# EAGLE design H2OhNo (EAGLE 6.4)
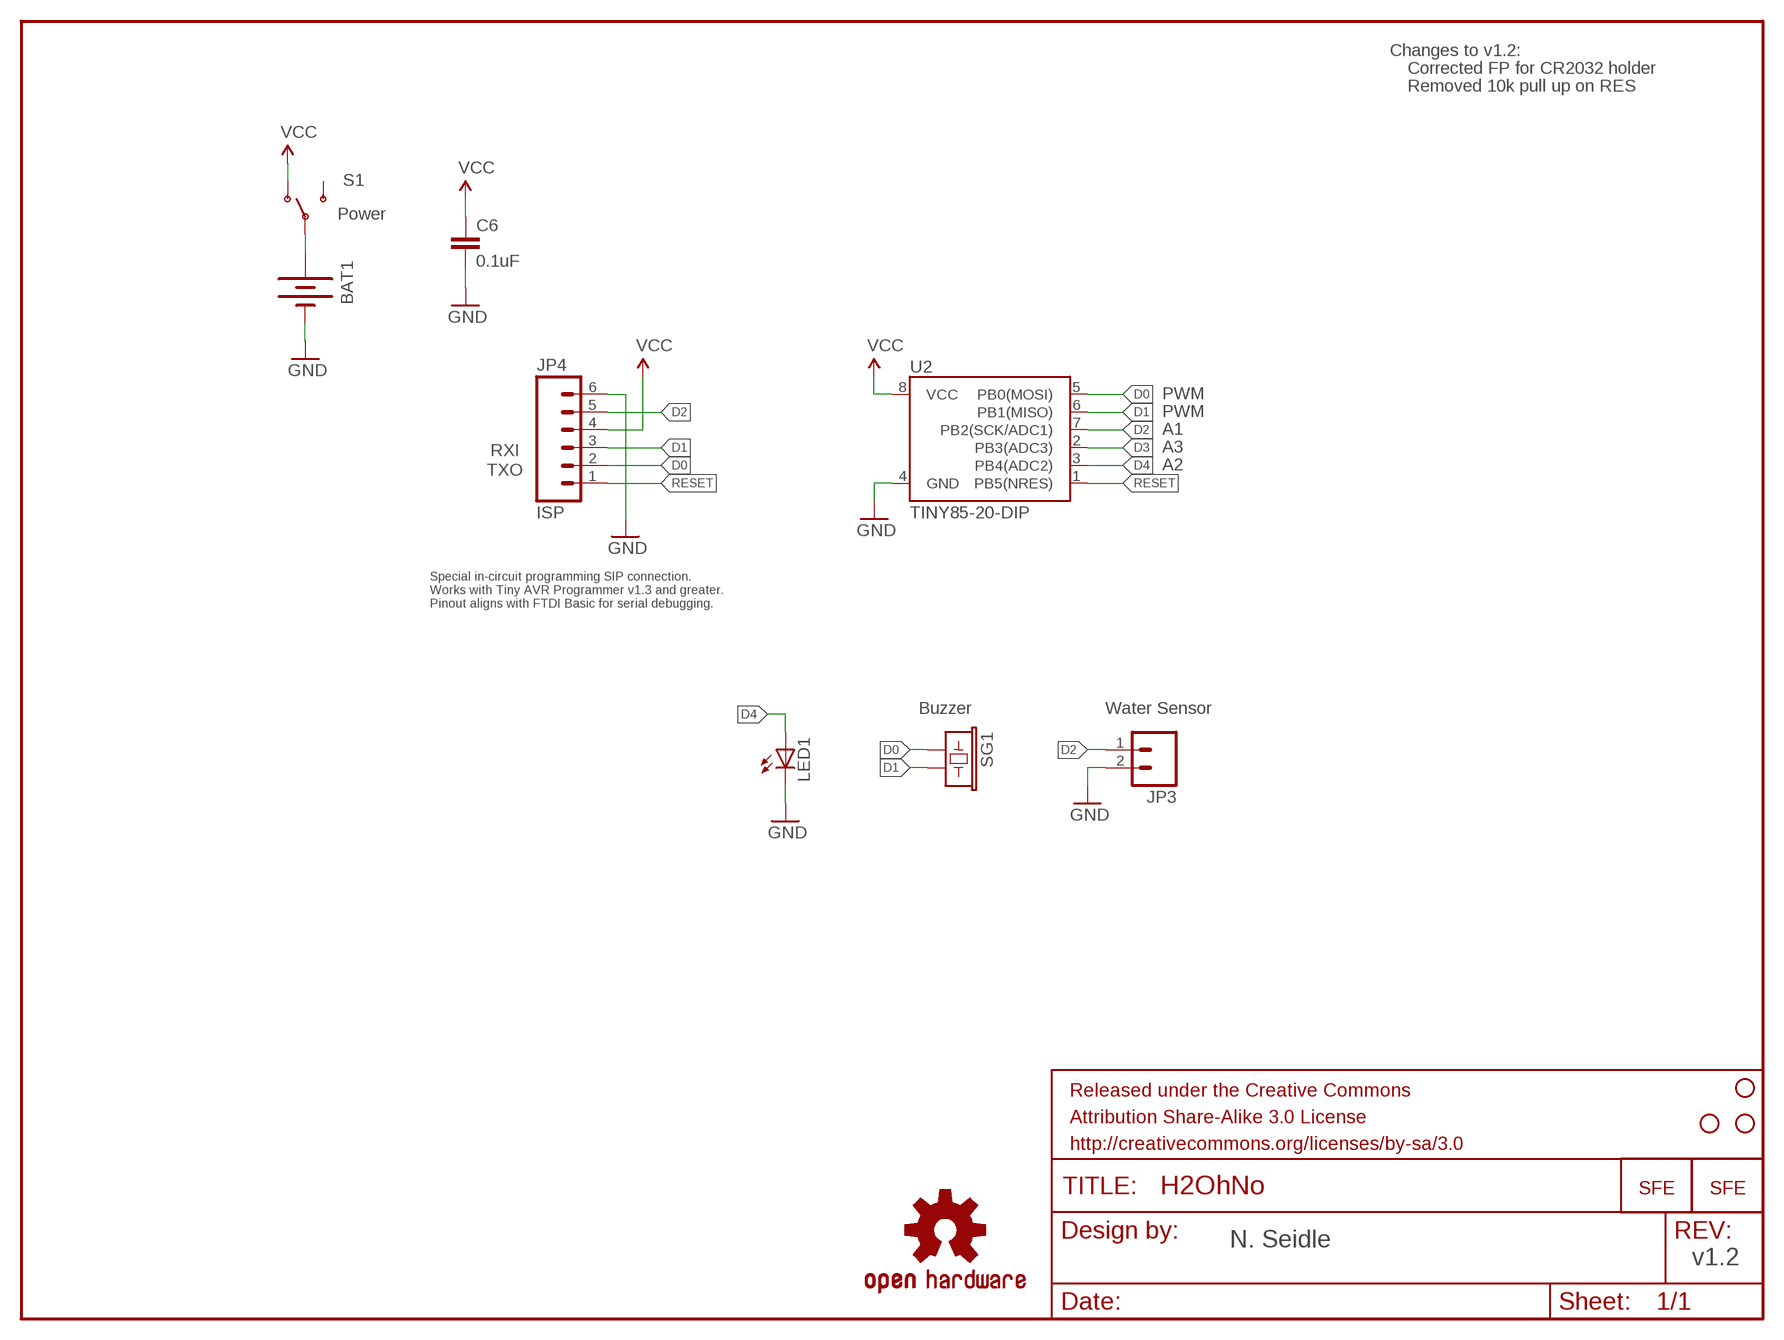
[diagram p0: schematic, sheet 1]

## Parts
BAT1  BATTERY20PTH  [BATTCOM_20MM_PTH]
C6  0.1uF  CAPPTH2  [CAP-PTH-SMALL2]
FRAME2  FRAME-LETTER  [CREATIVE_COMMONS]
JP3  Water Sensor  M02PTH  [1X02]
JP4  ISP  M06SIP  [1X06]
LED1  LED5MM  [LED5MM]
S1  Power  SWITCH-SPDTPTH  [SWITCH-SPDT]
SG1  Buzzer  BUZZERPTH  [BUZZER-12MM]
STANDOFF1  STAND-OFF  [STAND-OFF]
STANDOFF3  STAND-OFF  [STAND-OFF]
STANDOFF4  STAND-OFF  [STAND-OFF]
U2  TINY85-20-DIP  ATTINY45TINY85-20-DIP  [DIP08]
U$1  LOGO-SFESK  [SFE-LOGO-FLAME]
U$4  OSHW-LOGOS  [OSHW-LOGO-S]
U$5  LOGO-SFENW2  [SFE-NEW-WEB]

## Nets
D0: JP4.2 SG1.+ U2.5(PB0(MOSI))
D1: JP4.3 SG1.- U2.6(PB1(MISO))
D2: JP3.1 JP4.5 U2.7(PB2(SCK/ADC1))
D3: U2.2(PB3(ADC3))
D4: LED1.A U2.3(PB4(ADC2))
GND: BAT1.2(-) C6.2 JP3.2 JP4.6 LED1.K(C) U2.4(GND)
N$1: BAT1.1(+) S1.2(P)
RESET: JP4.1 U2.1(PB5(NRES))
VCC: C6.1 JP4.4 S1.1(O) U2.8(VCC)
Unconnected: S1.3(S)

## Notes on the sheet
- Changes to v1.2:
- Corrected FP for CR2032 holder
- Removed 10k pull up on RES
- PWM
- PWM
- A1
- RXI | A3
- A2
- TXO
- Special in-circuit programming SIP connection. 
  Works with Tiny AVR Programmer v1.3 and greater.
  Pinout aligns with FTDI Basic for serial debugging.
- N. Seidle
- v1.2

## Library data of the parts
BAT1 = SparkFun-Electromechanical:BATTERY: Battery Holders Various common sizes : AA, AAA, 20mm coin cell and 12mm coin cell. 20MM_4LEGS, BATT-10373
C6 = SparkFun:CAP: Capacitor Standard 0603 ceramic capacitor, and 0.1" leaded capacitor.
FRAME2 = SparkFun-Aesthetics:FRAME-LETTER: Schematic Frame Standard 8.5x11 US Letter frame
JP3 = SparkFun-Connectors:M02: Standard 2-pin 0.1" header. Use with - straight break away headers ( PRT-00116) - right angle break away headers (PRT-00553) - swiss pins (PRT-00743) - machine pins (PRT-00117) - female headers (PRT-00115) Molex polarized connector foot print use with: PRT-08233 with associated crimp pins and housings. 2.54_SCREWTERM for use with PRT-10571. 3.5mm Screw Terminal footprints for PRT-08084 5mm Screw Terminal footprints for use with PRT-08433
JP4 = SparkFun-Connectors:M06: Header 6 Standard 6-pin 0.1" header. Use with straight break away headers (SKU : PRT-00116), right angle break away headers (PRT-00553), swiss pins (PRT-00743), machine pins (PRT-00117), and female headers (PRT-00115). Molex polarized connector foot print use with SKU : PRT-08094 with associated crimp pins and housings. NOTES ON THE VARIANTS LOCK and LOCK_LONGPADS... This footprint was designed to help hold the alignment of a through-hole component (i.e. 6-pin header) while soldering it into place. You may notice that each hole has been shifted either up or down by 0.005 of an inch from it's more standard position (which is a perfectly straight line). This slight alteration caused the pins (the squares in the middle) to touch the edges of the holes. Because they are alternating, it causes a "brace" to hold the component in place. 0.005 has proven to be the perfect amount of "off-center" position when using our standard breakaway headers. Although looks a little odd when you look at the bare footprint, once you have a header in there, the alteration is very hard to notice. Also,if you push a header all the way into place, it is covered up entirely on the bottom side. This idea of altering the position of holes to aid alignment will be further integrated into the Sparkfun Library for other footprints. It can help hold any component with 3 or more connection pins.
LED1 = SparkFun-LED:LED: LEDs Standard schematic elements and footprints for 5mm, 3mm, 1206, and 0603 sized LEDs. 5mm - Spark Fun Electronics SKU : COM-00529 (and others)
S1 = SparkFun-Electromechanical:SWITCH-SPDT: SPDT Switch Simple slide switch, Spark Fun Electronics SKU : COM-00102 DPDT SMT slide switch, AYZ0202, SWCH-08179
SG1 = SparkFun-Electromechanical:BUZZER: Buzzer 12mm Spark Fun Electronics SKU : Comp-Buzzer
STANDOFF1 STANDOFF3 STANDOFF4 = SparkFun-Electromechanical:STAND-OFF: #4 Stand Off This is the mechanical footprint for a #4 phillips button head screw. Use the keepout ring to avoid running the screw head into surrounding components. SKU : PRT-00447
U2 = SparkFun-DigitalIC:ATTINY45: Atmel 8-pin 2/4/8kB flash uC; PROD_ID: IC-09445
U$1 U$5 = SparkFun:LOGO-SFE: Spark Fun Electronics PCB Logo This is the standard Spark Fun Electronics PCB logo.
U$4 = SparkFun:OSHW-LOGO: Open Source Hardware Logo This logo indicates the piece of hardware it is found on incorporates a OSHW license and/or adheres to the definition of open source hardware found here: http://freedomdefined.org/OSHW

## Board
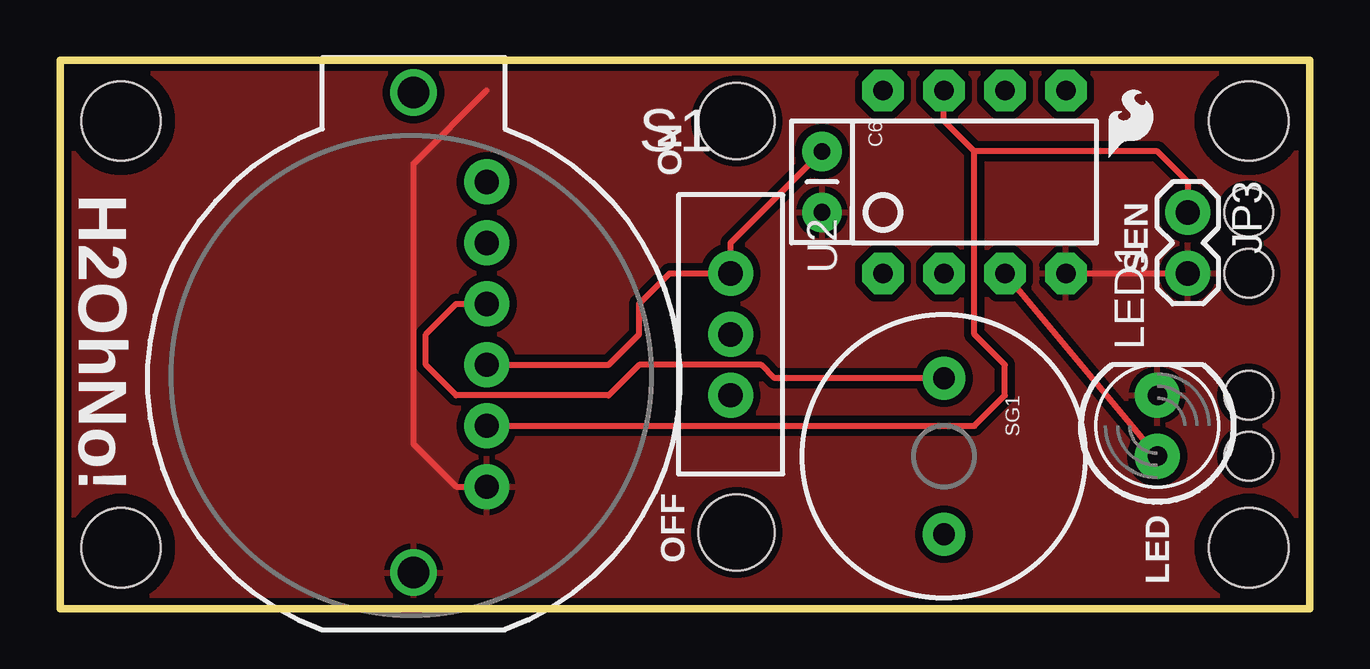
[diagram p1: board, top side]
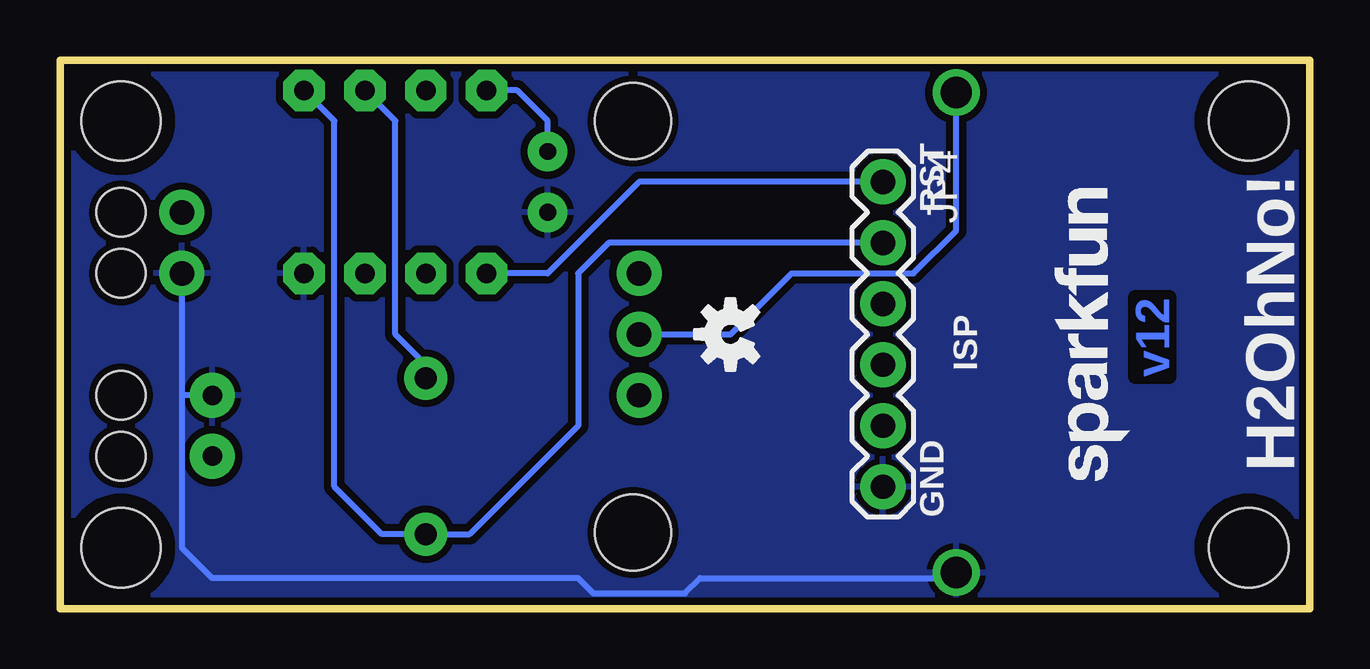
[diagram p2: board, bottom side, seen from below]

Size 52.07 x 22.86 mm. Coordinates in mm from the lower left corner, seen from the top.
Outline: 0,22.86 0,0 52.07,0 52.07,22.86 0,22.86
Copper layers (1*16): Top 0.035mm / dielectric 1.5mm / Bottom 0.035mm
Design rules "SparkFun": minimum track width 8mil, minimum drill 20mil, track to track 8mil, track to pad 8mil, pad to pad 8mil, via to via 8mil, smd to smd 8mil, copper to edge 10mil, drill to drill 8mil, minimum pad ring 12mil, minimum via ring 10mil, stop-mask expansion 4mil, vias tented up to drill 25mil, thermal gap 10mil
Holes 3.17 mm at 28.19,20.32 28.19,3.17
Holes 2.03 mm at 49.53,16.51 49.53,13.97 49.53,6.35 49.53,8.89

### Footprints (pad centres in the part's own frame; a part is rotated, then mirrored left to right if it is on the bottom)
BATTCOM_20MM_PTH = drill 1.3: 1 11.85,0; 2 -8.15,0
CAP-PTH-SMALL2 = drill 0.7 pad 1.651: 1 0,0; 2 2.54,0
1X02 = drill 1.016 pad 1.88: 1 0,0; 2 2.54,0
1X06 = drill 1.016 pad 1.88: 1 0,0; 2 2.54,0; 3 5.08,0; 4 7.62,0; 5 10.16,0; 6 12.7,0
LED5MM = drill 0.813 pad 1.88: A -1.27,0; K 1.27,0
SWITCH-SPDT = drill 1.016 pad 1.88: 1 0,2.54; 2 0,0; 3 0,-2.54
BUZZER-12MM = drill 0.9 pad 1.778: + 3.25,0; - -3.25,0
STAND-OFF = hole 3.302: 0,0
DIP08 = drill 0.813 pad 1.727 octagon: 1 -3.81,-3.81; 2 -1.27,-3.81; 3 1.27,-3.81; 4 3.81,-3.81; 5 3.81,3.81; 6 1.27,3.81; 7 -1.27,3.81; 8 -3.81,3.81

### Placement (x,y rotation side)
BAT1  14.73,9.65 90 top
C6  31.75,19.05 270 top
FRAME2  -6.35,-19.05 0 top  (outside the outline)
JP3  46.99,16.51 270 top
JP4  17.78,17.78 270 bottom
LED1  45.72,7.62 90 top
S1  27.94,11.43 0 top
SG1  36.83,6.35 270 top
STANDOFF1  2.54,2.54 0 top
STANDOFF2  STAND-OFF  [STAND-OFF]  2.54,20.32 0 top
STANDOFF3  49.53,20.32 0 top
STANDOFF4  49.53,2.54 0 top
U2  38.1,17.78 0 top
U$1  43.69,18.8 0 top
U$4  24.13,11.43 90 bottom
U$5  7.49,5.33 90 bottom

### Tracks (layer width: path | path; a pad name or v marks a point on that pad's centre or on a via)
D0
  Bottom 0.254: JP4.2 29.21,15.24 30.48,13.97 30.48,7.62 35,3.1 SG1.+ 38.66,3.1 40.64,5.08 40.64,20.32 U2.5
D1
  Top 0.254: SG1.- 29.77,9.6 29.21,10.16 24.13,10.16 22.86,8.89 16.51,8.89 15.24,10.16 15.24,11.43 16.51,12.7 JP4.3
  Bottom 0.254: U2.6 38.1,20.32 38.1,11.43 36.83,10.16 SG1.-
D2
  Top 0.254: JP4.5 38.1,7.62 39.37,8.89 39.37,10.16 38.1,11.43 38.1,19.05 | JP3.1 46.99,17.78 45.72,19.05 38.1,19.05 | 38.1,19.05 36.83,20.32 U2.7
D4
  Top 0.254: U2.3 LED1.A
GND
  Top 0.254: 17.78,21.59 14.73,18.54 14.73,6.86 16.51,5.08 JP4.6 | U2.4 JP3.2
  Bottom 0.254: 14.86,1.27 25.4,1.27 26.04,0.64 29.84,0.64 30.48,1.27 45.72,1.27 46.99,2.54 46.99,8.89 | JP3.2 46.99,8.89 | LED1.K 46.99,8.89
  pour Bottom (isolate 0.305): 0,22.86 52.07,22.86 52.07,0 0,0
  pour Top (isolate 0.305): 0,22.86 52.07,22.86 52.07,0 0,0
N$1
  Bottom 0.254: S1.2 24.13,11.43 21.59,13.97 16.51,13.97 14.73,15.75 BAT1.1
RESET
  Bottom 0.254: JP4.1 27.94,17.78 31.75,13.97 U2.1
VCC
  Top 0.254: JP4.4 22.86,10.16 24.13,11.43 24.13,12.7 25.4,13.97 S1.1 27.94,15.24 C6.1
  Bottom 0.254: C6.1 31.75,20.32 33.02,21.59 U2.8

### Text on the board
Bottom: v12
tPlace: ON | H2OhNo! | SEN | OFF | LED
bPlace: RST | ISP | H2OhNo! | GND
Document: N. Seidle